# Altium schematic sheet STSPIN32F0A 3-ph BLDC Motor Driver.SchDoc: STSPIN32F0A 3-ph BLDC Motor Driver
size A4
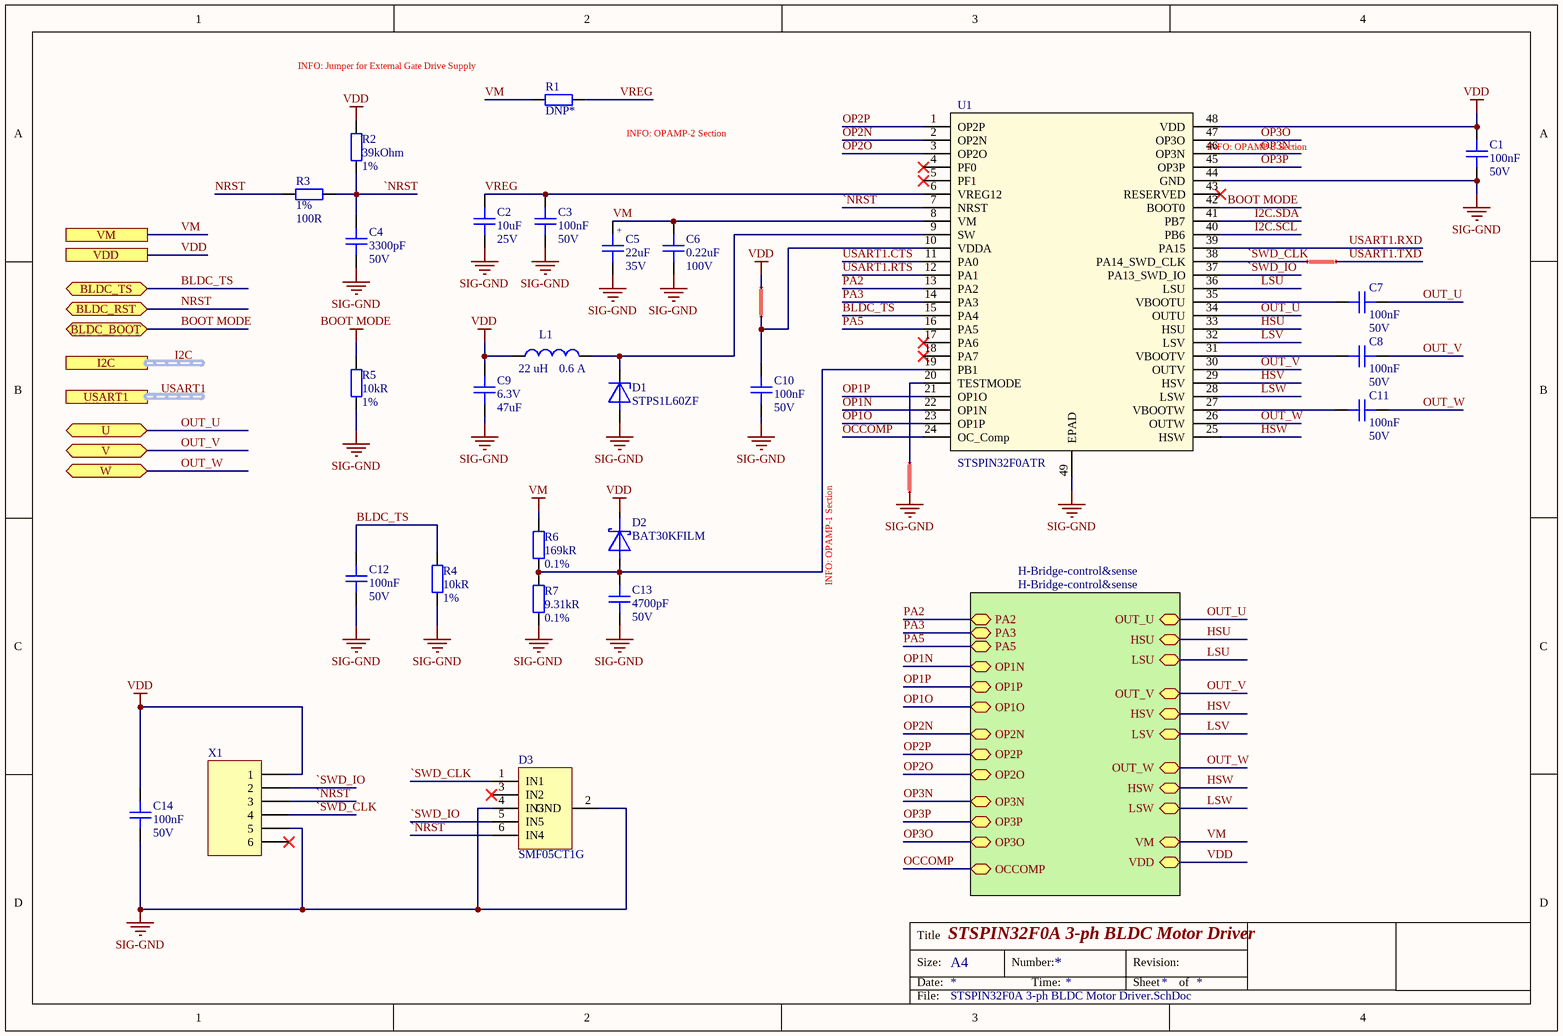
[diagram p0: STSPIN32F0A 3-ph BLDC Motor Driver.SchDoc]

## Parts
C1  Capacitance: 100nF  Voltage: 50V  [C0402]  (hidden comment: CAP CER 0.1UF 50V X7R 0402)
C2  Capacitance: 10uF  Voltage Rating: 25V  [C1206]  (hidden comment: CAP CER 10UF 25V X7R 1206)
C3  Capacitance: 100nF  Voltage: 50V  [C0402]  (hidden comment: CAP CER 0.1UF 50V X7R 0402)
C4  Capacitance: 3300pF  Voltage Rating: 50V  [C0402]  (hidden comment: CAP CER 0402 3.3NF 50V X7R 10%)
C5  Capacitance: 22uF  Rated Voltage: 35V  [CT7343]  (hidden comment: CAP TANT 22UF 10% 35V 2917)
C6  Capacitance: 0.22uF  Voltage Rating: 100V  [C0805]  (hidden comment: CAP CER 220NF 100V X7R 0805)
C7  Capacitance: 100nF  Voltage: 50V  [C0402]  (hidden comment: CAP CER 0.1UF 50V X7R 0402)
C8  Capacitance: 100nF  Voltage: 50V  [C0402]  (hidden comment: CAP CER 0.1UF 50V X7R 0402)
C9  Voltage Rating: 6.3V  Capacitance: 47uF  [C0603]  (hidden comment: CAP CER 47UF 6.3V X5R 0603)
C10  Capacitance: 100nF  Voltage: 50V  [C0402]  (hidden comment: CAP CER 0.1UF 50V X7R 0402)
C11  Capacitance: 100nF  Voltage: 50V  [C0402]  (hidden comment: CAP CER 0.1UF 50V X7R 0402)
C12  Capacitance: 100nF  Voltage: 50V  [C0402]  (hidden comment: CAP CER 0.1UF 50V X7R 0402)
C13  Capacitance: 4700pF  Voltage Rating: 50V  [C0402]  (hidden comment: CAP CER 0402 4.7NF 50V X7R 10%)
C14  Capacitance: 100nF  Voltage: 50V  [C0402]  (hidden comment: CAP CER 0.1UF 50V X7R 0402)
D1  STPS1L60ZF  [SOD-123FL]
D2  BAT30KFILM  [SOD-523]
D3  SMF05CT1G  [SOT363_SOP65P210X265-6N]
J1  Net Tie  [Net Tie 6x30mil]  (value not drawn)  (net tie, no BOM)
J2  Net Tie  [Net Tie 6x30mil]  (value not drawn)  (net tie, no BOM)
J3  Net Tie  [Net Tie 6x30mil]  (value not drawn)  (net tie, no BOM)
L1  Inductance: 22 uH  Maximum DC Current: 0.6 A  [IND_WE_LQSH_3015]  (hidden comment: FIXED IND 22UH 600MA 450MOHM SMD)
R1  DNP*  [R0402]  (no BOM)
R2  Resistance: 39kOhm  Tolerance: 1%  [R0402]  (hidden comment: RES SMD 39K OHM 1% 1/16W 0402)
R3  Tolerance: 1%  Resistance: 100R  [R0402]  (hidden comment: RES SMD 100 OHM 1% 1/16W 0402)
R4  Resistance: 10kR  Tolerance: 1%  [R0402]  (hidden comment: RES SMD 10K OHM 1% 1/16W 0402)
R5  Resistance: 10kR  Tolerance: 1%  [R0402]  (hidden comment: RES SMD 10K OHM 1% 1/16W 0402)
R6  Resistance: 169kR  Tolerance: 0.1%  [R0603]  (hidden comment: RES 169K OHM 0.1% 1/8W 0603)
R7  Resistance: 9.31kR  Tolerance: 0.1%  [R0603]  (hidden comment: RES SMD 9.31KOHM 0.1% 1/10W 0603)
U1  STSPIN32F0ATR  [VFQFPN-48]
X1  (no value)  [TC2030-IDC-NL]  (no BOM)

## Sub-sheets
H-Bridge-control&sense = H-Bridge-control&sense: PA2 (bidir), OUT_U (bidir), HSU (bidir), LSU (bidir), OUT_V (bidir), HSV (bidir), LSV (bidir), OUT_W (bidir), HSW (bidir), LSW (bidir), PA3 (bidir), OP1N (bidir), PA5 (bidir), OP1P (bidir), OP1O (bidir), OP2N (bidir), OP2P (bidir), OP2O (bidir), OP3N (bidir), OP3P (bidir), OP3O (bidir), OCCOMP (bidir), VM (bidir), VDD (bidir)

## Ports
BLDC_BOOT (bidir), BLDC_RST (bidir), BLDC_TS (bidir), I2C (harness I2C), U (bidir), USART1 (harness UART), V (bidir), VDD, VM, W (bidir)

## Nets
BOOT MODE: R5.1 U1.42(BOOT0) ; port BLDC_BOOT
SIG-GND: C1.2 C2.1 C3.2 C4.1 C5.2 C6.1 C9.1 C10.2 C12.1 C13.1 C14.1 D1.2(A) D3.2(GND) D3.4(IN3) J3.1 R4.2 R5.2 R7.1 U1.44(GND) U1.49(EPAD) X1.5
VDD: C1.1 C9.2 C14.2 D2.1(K) J2.2 L1.1 R2.1 U1.48(VDD) X1.1 ; port VDD, sheet H-Bridge-control&sense/VDD
VM: C5.1 C6.2 R1.2 R6.2 U1.8(VM) ; port VM, sheet H-Bridge-control&sense/VM
`NRST: C4.2 D3.6(IN4) R2.2 R3.1 U1.7(NRST) X1.3
`SWD_CLK: D3.1(IN1) J1.1 U1.38(PA14_SWD_CLK) X1.4
`SWD_IO: D3.5(IN5) U1.37(PA13_SWD_IO) X1.2
BLDC_TS: C12.2 R4.1 U1.15(PA4) ; port BLDC_TS
HSU: U1.33(HSU) ; sheet H-Bridge-control&sense/HSU
HSV: U1.29(HSV) ; sheet H-Bridge-control&sense/HSV
HSW: U1.25(HSW) ; sheet H-Bridge-control&sense/HSW
I2C.SCL: U1.40(PB6)
I2C.SDA: U1.41(PB7)
LSU: U1.36(LSU) ; sheet H-Bridge-control&sense/LSU
LSV: U1.32(LSV) ; sheet H-Bridge-control&sense/LSV
LSW: U1.28(LSW) ; sheet H-Bridge-control&sense/LSW
NRST: R3.2 ; port BLDC_RST
OCCOMP: U1.24(OC_Comp) ; sheet H-Bridge-control&sense/OCCOMP
OP1N: U1.22(OP1N) ; sheet H-Bridge-control&sense/OP1N
OP1O: U1.23(OP1P) ; sheet H-Bridge-control&sense/OP1O
OP1P: U1.21(OP1O) ; sheet H-Bridge-control&sense/OP1P
OP2N: U1.2(OP2N) ; sheet H-Bridge-control&sense/OP2N
OP2O: U1.3(OP2O) ; sheet H-Bridge-control&sense/OP2O
OP2P: U1.1(OP2P) ; sheet H-Bridge-control&sense/OP2P
OP3N: U1.46(OP3N) ; sheet H-Bridge-control&sense/OP3N
OP3O: U1.47(OP3O) ; sheet H-Bridge-control&sense/OP3O
OP3P: U1.45(OP3P) ; sheet H-Bridge-control&sense/OP3P
OUT_U: C7.2 U1.34(OUTU) ; port U, sheet H-Bridge-control&sense/OUT_U
OUT_V: C8.2 U1.30(OUTV) ; port V, sheet H-Bridge-control&sense/OUT_V
OUT_W: C11.2 U1.26(OUTW) ; port W, sheet H-Bridge-control&sense/OUT_W
PA2: U1.13(PA2) ; sheet H-Bridge-control&sense/PA2
PA3: U1.14(PA3) ; sheet H-Bridge-control&sense/PA3
PA5: U1.16(PA5) ; sheet H-Bridge-control&sense/PA5
USART1.CTS: U1.11(PA0)
USART1.RTS: U1.12(PA1)
USART1.RXD: U1.39(PA15)
USART1.TXD: J1.2
VREG: C2.2 C3.1 R1.1 U1.6(VREG12)
NetC7_1: C7.1 U1.35(VBOOTU)
NetC8_1: C8.1 U1.31(VBOOTV)
NetC10_1: C10.1 J2.1 U1.10(VDDA)
NetC11_1: C11.1 U1.27(VBOOTW)
NetC13_2: C13.2 D2.2(A) R6.1 R7.2 U1.19(PB1)
NetD1_1: D1.1(K) L1.2 U1.9(SW)
NetJ3_2: J3.2 U1.20(TESTMODE)

Not connected (* = marked no-connect by the designer): D3 3(IN2)*; U1 4(PF0)* 5(PF1)* 17(PA6)* 18(PA7)* 43(RESERVED)*; X1 6*

## Buses and harness runs
harness I2C = port I2C
harness USART1 = port USART1

## Notes on the sheet
- (near R1) INFO: Jumper for External Gate Drive Supply
- INFO: OPAMP-2 Section
- INFO: OPAMP-3 Section
- INFO: OPAMP-1 Section
- Title
- Size:
- Date:
- A4
- Number:
- Time:
- Revision:
- Sheet
- of
- File:
- (in symbol CAP TANT 22UF 10% 35V 2917) +

## Library data of the parts
C1 C3 C7 C8 C10-C12 C14 = CAP CER 0.1UF 50V X7R 0402: 0.1µF ±10% 50V Ceramic Capacitor X7R 0402 (1005 Metric); Manufacturer: TDK; Manufacturer Part Number: CGA2B3X7R1H104K050BB; Supplier 1: Digi-Key; Stock 1: 2925303; Pricing 1: 1=0.17, 10=0.118, 50=0.0668, 100=0.0553, 500=0.0388, 1000=0.0321, 2500=0.0299, 5000=0.0273 (USD); Mount: Surface Mount; Case/Package: 0402; Weight: 2.3E-05oz; Case Code (Metric): 1005; Case Code (Imperial): 0402; Min Operating Temperature: -55°C; Max Operating Temperature: 125°C; Voltage Rating: 50V; Tolerance: 10%; Packaging: Tape and Reel; Package Quantity: 1; Voltage Rating (DC): 50V; Dielectric: X7R; Termination: SMD/SMT; Composition: Ceramic; Length: 1mm; Height: 0.5mm; Width: 0.02inch; Thickness: 0.022inch; Depth: 0.5mm; Ratings: AEC-Q200; REACH SVHC: No SVHC; Lead Free: Lead Free; ComponentLink1URL: http://product.tdk.com/capacitor/mlcc/en/documents/mlccspec_automotive_general_midvoltage_en.pdf?src-supplier=Future+Electronics; ComponentLink1Description: http://product.tdk.com/capacitor/mlcc/en/documents/mlccspec_automotive_general_midvoltage_en.pdf?src-supplier=Future+Electronics; ComponentLink2URL: http://www.farnell.com/datasheets/1807242.pdf?src-supplier=Element14; ComponentLink2Description: http://www.farnell.com/datasheets/1807242.pdf?src-supplier=Element14; ComponentLink3URL: http://www.mouser.com/ds/2/400/lcc_automotive_general_en-843974.pdf?src-supplier=Mouser; ComponentLink3Description: http://www.mouser.com/ds/2/400/lcc_automotive_general_en-843974.pdf?src-supplier=Mouser; ComponentLink4URL: http://www.farnell.com/datasheets/1936565.pdf?src-supplier=Element14; ComponentLink4Description: http://www.farnell.com/datasheets/1936565.pdf?src-supplier=Element14; ComponentLink5URL: http://www.farnell.com/datasheets/1735392.pdf?src-supplier=Element14; ComponentLink5Description: http://www.farnell.com/datasheets/1735392.pdf?src-supplier=Element14; Supplier Part Number 1: 445-6899-1-ND
C2 = CAP CER 10UF 25V X7R 1206: 10µF ±10% 25V Ceramic Capacitor X7R 1206 (3216 Metric); Manufacturer: Yageo; Manufacturer Part Number: CC1206KKX7R8BB106; Supplier 1: Digi-Key; Stock 1: 3990; Pricing 1: 1=0.49, 10=0.348, 50=0.2632, 100=0.2293, 500=0.1698, 1000=0.1444 (USD); Mount: Surface Mount; Case/Package: 1206; Weight: 0.000571oz; Case Code (Imperial): 1206; Case Code (Metric): 3216; Min Operating Temperature: -55°C; Max Operating Temperature: 125°C; Tolerance: 10%; Packaging: Tape and Reel; Voltage Rating (DC): 25V; Dielectric: X7R; Termination: SMD/SMT; Composition: Ceramic; Length: 3.2mm; Width: 1.6mm; Thickness: 0.071inch; Depth: 1.6mm; Radiation Hardening: No; Lead Free: Lead Free; Halogen Free: Halogen Free; ComponentLink1URL: http://www.yageo.com/documents/recent/UPY-GPHC_X7R_6.3V-to-50V_8.pdf?src-supplier=Avnet; ComponentLink1Description: http://www.yageo.com/documents/recent/UPY-GPHC_X7R_6.3V-to-50V_8.pdf?src-supplier=Avnet; ComponentLink2URL: http://www.mouser.com/ds/2/447/Yageo_UPY-GP_NP0_16V-to-50V_9-358835.pdf?src-supplier=Mouser; ComponentLink2Description: http://www.mouser.com/ds/2/447/Yageo_UPY-GP_NP0_16V-to-50V_9-358835.pdf?src-supplier=Mouser; ComponentLink3URL: http://components.arrow.com/part/dataview/0323_04166677?src-supplier=Arrow+Europe; ComponentLink3Description: http://components.arrow.com/part/dataview/0323_04166677?src-supplier=Arrow+Europe; ComponentLink4URL: http://www.yageo.com/documents/recent/UPY-GPHC_X7R_6.3V-to-50V_18.pdf?src-supplier=Digi-Key; ComponentLink4Description: http://www.yageo.com/documents/recent/UPY-GPHC_X7R_6.3V-to-50V_18.pdf?src-supplier=Digi-Key; ComponentLink5URL: http://www.yageo.com/documents/recent/UPY-GPHC_X7R_6.3V-to-50V_9.pdf?src-supplier=Future+Electronics; ComponentLink5Description: http://www.yageo.com/documents/recent/UPY-GPHC_X7R_6.3V-to-50V_9.pdf?src-supplier=Future+Electronics; Supplier Part Number 1: 311-1959-1-ND
C4 = CAP CER 0402 3.3NF 50V X7R 10%: 3300 pF ±10% 50V Ceramic Capacitor X7R 0402 (1005 Metric); Manufacturer: KEMET; Manufacturer Part Number: C0402C332K5RECAUTO; Dissipation Factor: 0.1%; Supplier 1: Digi-Key; Stock 1: 57093; Pricing 1: 1=0.1, 10=0.021, 50=0.0116, 100=0.0095, 500=0.0068, 1000=0.0053, 2500=0.0048, 5000=0.0045 (USD); Mount: Surface Mount; Case/Package: 0402; Case Code (Metric): 1005; Case Code (Imperial): 0402; Dielectric Material: Ceramic; Min Operating Temperature: -55°C; Max Operating Temperature: 125°C; Tolerance: 10%; Packaging: Tape and Reel; Package Quantity: 10000; Voltage Rating (DC): 50V; Dielectric: X7R; Termination: SMD/SMT; Length: 1mm; Height: 0.5mm; Width: 0.02inch; Thickness: 0.022inch; Lead Pitch: 0.3mm; Depth: 0.5mm; Radiation Hardening: No; REACH SVHC: No SVHC; Lead Free: Lead Free; ComponentLink1URL: http://www.mouser.com/ds/2/212/KEM_C1003_C0G_SMD-1101588.pdf?src-supplier=Mouser; ComponentLink1Description: http://www.mouser.com/ds/2/212/KEM_C1003_C0G_SMD-1101588.pdf?src-supplier=Mouser; Supplier Part Number 1: 399-C0402C472K5RECAUTOCT-ND; ClassName: P109
C5 = CAP TANT 22UF 10% 35V 2917: 22 µF Molded Tantalum Capacitors 35 V 2917 (7343 Metric) 700mOhm; Manufacturer: KEMET; Manufacturer Part Number: T491X226K035AT; Endurance: 2000h; Capacitance Tolerance: +/-10%; Supplier 1: Digi-Key; Packaging: Tape and Reel; ComponentLink1URL: https://www.digikey.com/en/products/detail/kemet/T491X226K035AT/818676; ComponentLink1Description: Manufacturer; Supplier Part Number 1: 399-3816-2-ND; Height: 4.3mm; ComponentLink2URL: https://www.digikey.com/en/products/detail/kemet/T491X226K035AT/818676; ComponentLink2Description: Datasheet; Mounting Technology: SMT; Operating Temperature: -55 to +125degC; Dissipation Factor: 10%; Mount: Surface Mount
C6 = CAP CER 220NF 100V X7R 0805: 0.22 µF ±10% 100V Ceramic Capacitor X7R 0805 (2012 Metric); Manufacturer: KEMET; Manufacturer Part Number: C0805C224K1RECAUTO; Supplier 1: Digi-Key; Stock 1: 251380; Pricing 1: 1=0.3, 10=0.207, 100=0.1173, 500=0.0828, 1000=0.0725 (USD); Mount: Surface Mount; Case/Package: 0805; Case Code (Metric): 2012; Case Code (Imperial): 0805; Material: Ceramic; Min Operating Temperature: -55°C; Max Operating Temperature: 125°C; Tolerance: 10%; Packaging: Tape and Reel; Package Quantity: 2500; Length: 0.079inch; Width: 0.049inch; Thickness: 0.055inch; Depth: 1.25mm; Lead Free: Lead Free; ComponentLink1URL: https://www.digikey.com/en/products/detail/kemet/C0805C224K1RECAUTO/8640484; ComponentLink1Description: https://www.digikey.com/en/products/detail/kemet/C0805C224K1RECAUTO/8640484; Supplier Part Number 1: 399-17890-1-ND; Dielectric: X7R
C9 = CAP CER 47UF 6.3V X5R 0603: 47 µF ±20% 6.3V Ceramic Capacitor X5R 0603 (1608 Metric); Manufacturer: AVX Corporation; Manufacturer Part Number: 06036D476MAT2A; Supplier 1: Digi-Key; Stock 1: 325858; Pricing 1: 1=0.26, 10=0.18, 100=0.102, 500=0.072, 1000=0.063 (USD); Mount: Surface Mount; Case Code (Imperial): 0603; Case Code (Metric): 1608; Min Operating Temperature: -55°C; Max Operating Temperature: 85°C; Voltage Rating (DC): 6.3V; Tolerance: 20%; Packaging: Tape and Reel; Package Quantity: 1; Dielectric: X5R; Termination: SMD/SMT; Composition: Ceramic; Length: 1.6mm; Height: 0.8mm; Width: 0.8mm; Thickness: 0.035inch; Depth: 0.8mm; Radiation Hardening: No; REACH SVHC: Unknown; Lead Free: Lead Free; Halogen Free: Halogen Free; ComponentLink1URL: https://www.digikey.com/en/products/detail/avx-corporation/06036D476MAT2A/7563129?s=N4IgTCBcDaIAwDY4GYEBEAsB2BBZAggCpj4gC6AvkA; ComponentLink1Description: https://www.digikey.com/en/products/detail/avx-corporation/06036D476MAT2A/7563129?s=N4IgTCBcDaIAwDY4GYEBEAsB2BBZAggCpj4gC6AvkA; Supplier Part Number 1: 478-11180-1-ND; Case/Package: 0603
C13 = CAP CER 0402 4.7NF 50V X7R 10%: 4700 pF ±10% 50V Ceramic Capacitor X7R 0402 (1005 Metric); Manufacturer: KEMET; Manufacturer Part Number: C0402C472K5RECAUTO; Dissipation Factor: 0.1%; Supplier 1: Digi-Key; Stock 1: 57093; Pricing 1: 1=0.1, 10=0.021, 50=0.0116, 100=0.0095, 500=0.0068, 1000=0.0053, 2500=0.0048, 5000=0.0045 (USD); Mount: Surface Mount; Case/Package: 0402; Case Code (Metric): 1005; Case Code (Imperial): 0402; Dielectric Material: Ceramic; Min Operating Temperature: -55°C; Max Operating Temperature: 125°C; Tolerance: 10%; Packaging: Tape and Reel; Package Quantity: 10000; Voltage Rating (DC): 50V; Dielectric: X7R; Termination: SMD/SMT; Length: 1mm; Height: 0.5mm; Width: 0.02inch; Thickness: 0.022inch; Lead Pitch: 0.3mm; Depth: 0.5mm; Radiation Hardening: No; REACH SVHC: No SVHC; Lead Free: Lead Free; ComponentLink1URL: http://www.mouser.com/ds/2/212/KEM_C1003_C0G_SMD-1101588.pdf?src-supplier=Mouser; ComponentLink1Description: http://www.mouser.com/ds/2/212/KEM_C1003_C0G_SMD-1101588.pdf?src-supplier=Mouser; Supplier Part Number 1: 399-C0402C472K5RECAUTOCT-ND; ClassName: P109
D1 = DIODE SCHOTTKY 60V 1A SOD123F: Diode Schottky 60 V 1A Surface Mount SOD-123F; Manufacturer: STMicroelectronics; Working Voltage: 60V; Element Configuration: Single; Direction: Unidirectional; Supplier 1: Digi-Key; Manufacturer Part Number: STPS1L60ZF; Stock 1: 1919; Case/Package: SOD-123F; Number of Pins: 2; Contact Plating: Tin,Matte; Min Operating Temperature: -40°C; Max Operating Temperature: 175°C; Package Quantity: 3000; Packaging: Tape and Reel; If - Forward Current: 1A; Radiation Hardening: No; Lead Free: Lead Free; ComponentLink1URL: https://www.digikey.com/en/products/detail/stmicroelectronics/STPS1L60ZF/6709836; ComponentLink1Description: https://www.digikey.com/en/products/detail/stmicroelectronics/STPS1L60ZF/6709836; Supplier Part Number 1: 497-17151-1-ND; Mount: Surface Mount
D2 = DIODE SCHOTTKY 30V 300MA SOD523: Diode Schottky 30 V 300mA (DC) Surface Mount SOD-523; Manufacturer: STMicroelectronics; Forward Voltage: 530mV; Max Power Dissipation: 100mW; Max Repetitive Reverse Voltage (Vrrm): 30V; Element Configuration: Single; Supplier 1: Digi-Key; Manufacturer Part Number: BAT30KFILM; Stock 1: 28802; Case/Package: SOD-523; Number of Pins: 2; Contact Plating: Tin,Matte; Min Operating Temperature: -55°C; Max Operating Temperature: 125°C; Forward Current: 300mA; Package Quantity: 1; Packaging: Tape and Reel; Average Rectified Current: 300mA; Power Dissipation: 100mW; Termination: SMD/SMT; Max Reverse Voltage (DC): 30V; Lead Free: Lead Free; ComponentLink1URL: https://www.digikey.com/en/products/detail/stmicroelectronics/BAT30KFILM/1207019?s=N4IgTCBcDaIEIEEAqBmADAaQGIEkAyAsiALoC%2BQA; ComponentLink1Description: https://www.digikey.com/en/products/detail/stmicroelectronics/BAT30KFILM/1207019?s=N4IgTCBcDaIEIEEAqBmADAaQGIEkAyAsiALoC%2BQA; Supplier Part Number 1: 497-5552-1-ND; Mount: Surface Mount
D3 = TVS DIODE 5V 12.5V 5CH SC88: 12.5V Clamp 8A (8/20µs) Ipp Tvs Diode Surface Mount SC-88/SC70-6/SOT-363; Manufacturer: ON Semiconductor; Capacitance: 130pF; Direction: Unidirectional; Reverse Breakdown Voltage: 6.2V; Number of Elements: 5; Reverse Standoff Voltage: 5V; Peak Pulse Power: 100W; Power Line Protection: No; Leakage Current: 5uA; Test Current: 1mA; ESD Protection: Yes; Max Breakdown Voltage: 7.2V; Element Configuration: Common Anode; Supplier 1: Digi-Key; Manufacturer Part Number: SMF05CT1G; Stock 1: 33811; Pricing 1: 1=0.41, 10=0.307, 25=0.2768, 100=0.1459, 250=0.1444, 500=0.1293, 1000=0.1006 (USD); Case/Package: SC; Number of Pins: 6; Min Operating Temperature: -40°C; Max Operating Temperature: 125°C; Packaging: Tape and Reel; Number of Channels: 5; Min Breakdown Voltage: 6.2V; Clamping Voltage: 12.5V; Peak Pulse Current: 8A; Polarity: Unidirectional; Working Voltage: 5V; Max Reverse Leakage Current: 5uA; Max Power Dissipation: 100W; Breakdown Voltage: 6.2V; Voltage Rating (DC): 5V; Length: 2mm; Height: 1mm; Width: 1.25mm; Depth: 1.25mm; Radiation Hardening: No; REACH SVHC: No SVHC; Lead Free: Lead Free; ComponentLink1URL: http://www.farnell.com/datasheets/1708354.pdf?src-supplier=Element14; ComponentLink1Description: http://www.farnell.com/datasheets/1708354.pdf?src-supplier=Element14; ComponentLink2URL: http://www.onsemi.com/pub/Collateral/SMF05C-D.PDF?src-supplier=Digi-Key; ComponentLink2Description: http://www.onsemi.com/pub/Collateral/SMF05C-D.PDF?src-supplier=Digi-Key; ComponentLink3URL: http://www.mouser.com/ds/2/308/SMF05C-D-100912.pdf?src-supplier=Mouser; ComponentLink3Description: http://www.mouser.com/ds/2/308/SMF05C-D-100912.pdf?src-supplier=Mouser; ComponentLink4URL: http://www.onsemi.com/pub/Collateral/SMF05C-D.PDF?src-supplier=Avnet; ComponentLink4Description: http://www.onsemi.com/pub/Collateral/SMF05C-D.PDF?src-supplier=Avnet; ComponentLink5URL: https://www.verical.com/server-webapp/html/getDatasheet?partID=98371&src-supplier=Verical; ComponentLink5Description: https://www.verical.com/server-webapp/html/getDatasheet?partID=98371&src-supplier=Verical; Supplier Part Number 1: SMF05CT1GOSCT-ND; Contact Plating: Tin,Matte; Package Quantity: 1; Max Surge Current: 8A; Number of Unidirectional Channels: 5; Termination: SMD/SMT; Power Dissipation: 100W; Max Output Current: 8A; Composition: Zener; Mount: Surface Mount
J1-J3 = Net Tie Line: ClassName: Net Tie
L1 = FIXED IND 22UH 600MA 450MOHM SMD: 22 µH Semi-Shielded Wirewound Inductor 600 mA 450mOhm Nonstandard; Manufacturer: Wurth Elektronik; Manufacturer Part Number: 74405031010; Self Resonant Frequency: 19 MHz; Tolerance: 20 %; Test Frequency: 1 MHz; RoHS: RoHS Compliant; Category: Fixed Inductors; Stock 1: 2000; Pricing 1: 1=0.730, 10=0.721, 50=0.601, 100=0.457, 1000=0.397, 2000=0.385 (USD); Application: Power; Height: 1.5 mm; Length: 3 mm; Maximum DC Resistance: 450 mOhms; Package / Case: 3 mm x 3 mm; Packaging: Cut Tape; Product: Fixed Inductors; Series: WE-LQSH; Shielding: Shielded; Termination Style: SMD/SMT; Width: 3 mm; Brand: Wurth Elektronik; Mounting Style: PCB Mount; Maximum Operating Temperature: + 125 C; Minimum Operating Temperature: - 40 C; Product Type: Fixed Inductors; Saturation Current: 0.6 A; Standard Pack Qty: 2000; Subcategory: Inductors, Chokes & Coils; Termination: -; RoHS - Mouser: Y; Minimum Order Quantity: 1; Reeling: True; ComponentLink1URL: https://www.mouser.com/datasheet/2/445/74405031010-1720907.pdf; ComponentLink1Description: https://www.mouser.com/datasheet/2/445/74405031010-1720907.pdf; Supplier 2: Digi-Key; Supplier Part Number 1: 732-5499-1-ND; Mount: Surface Mount
R1 = RES SMD NO BOM 0402: Placeholder for a 0402 resistor; Case/Package: 0402
R2 = RES SMD 39K OHM 1% 1/16W 0402: 39 kOhms ±1% 0.063W, 1/16W Chip Resistor 0402 (1005 Metric) Moisture Resistant Thick Film; Manufacturer Part Number: RC0402FR-0739KL; Manufacturer: Yageo; Temperature Coefficient: 100ppm/°C; Voltage Rating (DC): 50V; Power Rating: 62.5mW; Max Power Dissipation: 63mW; Supplier 1: Digi-Key; Stock 1: 2889310; Pricing 1: 1=0.1, 10=0.016, 100=0.0064, 1000=0.0029, 2500=0.0025, 5000=0.0021 (USD); Case Code (Imperial): 0402; Case Code (Metric): 1005; Min Operating Temperature: -55°C; Max Operating Temperature: 155°C; Composition: Thick Film; Packaging: Tape and Reel; Voltage Rating: 50V; Termination: SMD/SMT; Military Standard: Not; Number of Terminations: 2; Length: 1mm; Height: 0.016inch; Width: 0.02inch; Depth: 0.5mm; Lead Free: Lead Free; ComponentLink1URL: http://www.yageo.com/documents/recent/PYu-RC0402_51_RoHS_L_6_r.pdf?src-supplier=Future+Electronics; ComponentLink1Description: http://www.yageo.com/documents/recent/PYu-RC0402_51_RoHS_L_6_r.pdf?src-supplier=Future+Electronics; ComponentLink2URL: http://www.yageo.com/documents/recent/PYu-RC0402_51_RoHS_L_6_r.pdf?src-supplier=Mouser; ComponentLink2Description: http://www.yageo.com/documents/recent/PYu-RC0402_51_RoHS_L_6_r.pdf?src-supplier=Mouser; Supplier Part Number 1: 311-39.0KLRCT-ND; Case/Package: 0402; Weight: 10.729601oz; Package Quantity: 10000; Features: Moisture Resistant; Mount: Surface Mount
R3 = RES SMD 100 OHM 1% 1/16W 0402: 100 Ohms ±1% 0.063W, 1/16W Chip Resistor 0402 (1005 Metric) Moisture Resistant Thick Film; Manufacturer: Yageo; Manufacturer Part Number: RC0402FR-07100RL; Power Rating: 62.5mW; Voltage Rating: 50V; Temperature Coefficient: 100ppm/°C; Supplier 1: Digi-Key; Stock 1: 16989760; Pricing 1: 1=0.1, 10=0.016, 100=0.0064, 1000=0.0029, 2500=0.0025, 5000=0.0021 (USD); Case/Package: 0402; Number of Pins: 2; Case Code (Imperial): 0402; Case Code (Metric): 1005; Min Operating Temperature: -55°C; Max Operating Temperature: 155°C; Voltage Rating (DC): 50V; Packaging: Tape and Reel; Termination: SMD/SMT; Composition: Thick Film; Military Standard: Not; Length: 1mm; Height: 0.32mm; Width: 0.5mm; Depth: 0.5mm; REACH SVHC: No SVHC; Lead Free: Lead Free; ComponentLink1URL: http://www.farnell.com/datasheets/2167052.pdf?src-supplier=Element14; ComponentLink1Description: http://www.farnell.com/datasheets/2167052.pdf?src-supplier=Element14; ComponentLink2URL: http://www.yageo.com/documents/recent/PYu-RC_Group_51_RoHS_L_9.pdf?src-supplier=Mouser; ComponentLink2Description: http://www.yageo.com/documents/recent/PYu-RC_Group_51_RoHS_L_9.pdf?src-supplier=Mouser; ComponentLink3URL: http://www.yageo.com/documents/recent/PYu-RC0402_51_RoHS_L_6_r.pdf?src-supplier=Future+Electronics; ComponentLink3Description: http://www.yageo.com/documents/recent/PYu-RC0402_51_RoHS_L_6_r.pdf?src-supplier=Future+Electronics; ComponentLink4URL: https://www.verical.com/server-webapp/html/getDatasheet?partID=329466&src-supplier=Verical; ComponentLink4Description: https://www.verical.com/server-webapp/html/getDatasheet?partID=329466&src-supplier=Verical; ComponentLink5URL: http://www.farnell.com/datasheets/1018594.pdf?src-supplier=Element14; ComponentLink5Description: http://www.farnell.com/datasheets/1018594.pdf?src-supplier=Element14; ComponentLink6URL: http://documents.rs-components.com/techlib://itc_doclist_GB.htm?stockno=6185810&src-supplier=RSComponents; ComponentLink6Description: http://documents.rs-components.com/techlib://itc_doclist_GB.htm?stockno=6185810&src-supplier=RSComponents; Supplier Part Number 1: 311-100LRDKR-ND
R4 R5 = RES SMD 10K OHM 1% 1/16W 0402: 10 kOhms ±1% 0.063W, 1/16W Chip Resistor 0402 (1005 Metric) Moisture Resistant Thick Film; Manufacturer: Yageo; Manufacturer Part Number: RC0402FR-0710KP; Max Power Dissipation: 63mW; Temperature Coefficient: 150ppm/°C; Supplier 1: Digi-Key; Stock 1: 839368; Pricing 1: 1=0.1, 10=0.035, 100=0.014, 1000=0.0063, 2500=0.0055, 5000=0.0045 (USD); Case/Package: 0402; Case Code (Metric): 1005; Case Code (Imperial): 0402; Min Operating Temperature: -55°C; Max Operating Temperature: 155°C; Packaging: Tape and Reel; Composition: Thick Film; Number of Terminations: 2; Features: Moisture Resistant; Length: 0.039inch; Height: 0.016inch; Width: 0.02inch; ComponentLink1URL: http://www.yageo.com/NewPortal/yageodocoutput?fileName=/pdf/R-Chip/PYu-RC_51_RoHS_P_0.pdf&src-supplier=Digi-Key; ComponentLink1Description: http://www.yageo.com/NewPortal/yageodocoutput?fileName=/pdf/R-Chip/PYu-RC_51_RoHS_P_0.pdf&src-supplier=Digi-Key; Supplier Part Number 1: YAG1249CT-ND; Mount: Surface Mount
R6 = RES 169K OHM 0.1% 1/8W 0603: 169 kOhms ±0.1% 0.125W, 1/8W Chip Resistor 0603 (1608 Metric) Anti-Sulfur, Automotive AEC-Q200, Moisture Resistant Thin Film; Manufacturer Part Number: TNPW0603169KBEEA; Manufacturer: Vishay Dale; Temperature Coefficient: 25ppm/°C; Voltage Rating: 75V; Power Rating: 125mW; Supplier 1: Digi-Key; Stock 1: 18141; Pricing 1: 1=0.1, 10=0.04, 100=0.0164, 1000=0.0074, 2500=0.0064 (USD); Case Code (Imperial): 0603; Case Code (Metric): 1608; Min Operating Temperature: -55°C; Max Operating Temperature: 155°C; Composition: Thick Film; Packaging: Tape and Reel; Termination: SMD/SMT; Military Standard: Not; Number of Terminations: 2; Length: 1.55mm; Height: 0.02inch; Width: 0.85mm; Depth: 0.85mm; Lead Free: Lead Free; ComponentLink1URL: https://www.digikey.com/en/products/detail/vishay-dale/TNPW0603169KBEEA/1607019?s=N4IgTCBcDaICoDkAKB1ADANjQZgIwYE4BpAIQFEyBBEAXQF8g; ComponentLink1Description: https://www.digikey.com/en/products/detail/vishay-dale/TNPW0603169KBEEA/1607019?s=N4IgTCBcDaICoDkAKB1ADANjQZgIwYE4BpAIQFEyBBEAXQF8g; Supplier Part Number 1: 541-4530-1-ND; Case/Package: 0603; Weight: 7.1E-05oz; Contact Plating: Tin; Package Quantity: 5000; Max Power Dissipation: 125mW; Features: Automotive AEC-Q200; Radiation Hardening: No; Mount: Surface Mount
R7 = RES SMD 9.31KOHM 0.1% 1/10W 0603: 9.31 kOhms ±0.1% 0.1W, 1/10W Chip Resistor 0603 (1608 Metric) Anti-Sulfur, Automotive AEC-Q200 Thin Film; Manufacturer Part Number: RG1608P-9311-B-T5; Manufacturer: Susumu; Temperature Coefficient: 25ppm/°C; Voltage Rating: 75V; Power Rating: 125mW; Supplier 1: Digi-Key; Stock 1: 18141; Pricing 1: 1=0.1, 10=0.04, 100=0.0164, 1000=0.0074, 2500=0.0064 (USD); Case Code (Imperial): 0603; Case Code (Metric): 1608; Min Operating Temperature: -55°C; Max Operating Temperature: 155°C; Composition: Thick Film; Packaging: Tape and Reel; Termination: SMD/SMT; Military Standard: Not; Number of Terminations: 2; Length: 1.55mm; Height: 0.02inch; Width: 0.85mm; Depth: 0.85mm; Lead Free: Lead Free; ComponentLink1URL: https://www.digikey.com/en/products/detail/susumu/RG1608P-9311-B-T5/1240647?s=N4IgTCBcDaIEoHECMA2ADADgAoFoCcAzEkjgEI4AqArCALoC%2BQA; ComponentLink1Description: https://www.digikey.com/en/products/detail/susumu/RG1608P-9311-B-T5/1240647?s=N4IgTCBcDaIEoHECMA2ADADgAoFoCcAzEkjgEI4AqArCALoC%2BQA; Supplier Part Number 1: RG16P9.31KBTR-ND; Case/Package: 0603; Weight: 7.1E-05oz; Contact Plating: Tin; Package Quantity: 5000; Max Power Dissipation: 125mW; Features: Anti-Sulfur, Automotive AEC-Q200; Radiation Hardening: No; Mount: Surface Mount
U1 = IC BLDC CTLR STM32 48VFQFPN: Multiphase Motor Driver Power MOSFET Analog, I²C, PWM 48VFQFPN; Manufacturer: STMicroelectronics; Number of Outputs: 3 Output; Operating Frequency: 100 kHz; Output Voltage: 3.3 V; Operating Supply Current: 5 mA; Operating Supply Voltage: 6.7 V to 45 V; Manufacturer Part Number: STSPIN32F0ATR; RoHS: RoHS Compliant; Category: Motor / Motion / Ignition Controllers & Drivers; Stock 1: 2979; Features: Buck Step Down Converter, Initial Position Detect (IPD), Rotor Lock Protection, SPI/I2C, Integrated; Operating Temperature Range: - 40 C to + 125 C; Package / Case: 48VFQFPN; Packaging: Cut Tape; Product: Brushless DC Motor Controllers; Series: STSPIN32; Type: Half Bridge; Brand: STMicroelectronics; Mount: Surface Mount; Maximum Operating Temperature: + 125 C; Minimum Operating Temperature: - 40 C; Moisture Sensitive: Yes; Product Type: Motor / Motion / Ignition Controllers & Drivers; Standard Pack Qty: 3000; Subcategory: PMIC - Power Management ICs; RoHS - Mouser: Y; Minimum Order Quantity: 1; Reeling: True; Supplier 1: Digi-Key; Supplier Part Number 1: 497-19688-1-ND
X1 = TC2030-IDC-NL: Tag-Connect TC2030-MCP-NL (3x2 pins No Legs); Manufacturer: Tag-Connect LLC; Manufacturer Part Number: TC2030-IDC-NL